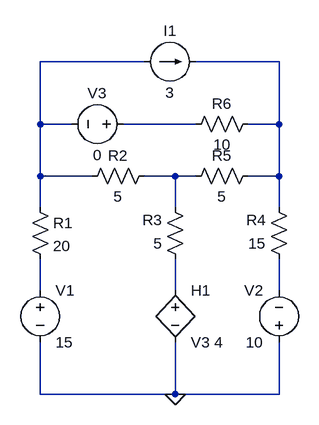
[diagram p0: schematic Draft29.asc]
Draft29.asc, the LTspice schematic file:
Version 4
SHEET 1 880 680
WIRE 208 -112 48 -112
WIRE 416 -112 288 -112
WIRE 48 -16 48 -112
WIRE 96 -16 48 -16
WIRE 288 -16 176 -16
WIRE 416 -16 416 -112
WIRE 416 -16 368 -16
WIRE 48 64 48 -16
WIRE 128 64 48 64
WIRE 256 64 208 64
WIRE 288 64 256 64
WIRE 416 64 416 -16
WIRE 416 64 368 64
WIRE 48 112 48 64
WIRE 256 112 256 64
WIRE 416 112 416 64
WIRE 48 240 48 192
WIRE 256 240 256 192
WIRE 416 240 416 192
WIRE 48 400 48 320
WIRE 256 400 256 320
WIRE 256 400 48 400
WIRE 416 400 416 320
WIRE 416 400 256 400
FLAG 256 400 0
SYMBOL voltage 48 224 R0
SYMATTR InstName V1
SYMATTR Value 15
SYMBOL res 32 96 R0
SYMATTR InstName R1
SYMATTR Value 20
SYMBOL res 224 48 R90
WINDOW 0 0 56 VBottom 2
WINDOW 3 32 56 VTop 2
SYMATTR InstName R2
SYMATTR Value 5
SYMBOL res 272 208 R180
WINDOW 0 36 76 Left 2
WINDOW 3 36 40 Left 2
SYMATTR InstName R3
SYMATTR Value 5
SYMBOL res 432 208 R180
WINDOW 0 36 76 Left 2
WINDOW 3 36 40 Left 2
SYMATTR InstName R4
SYMATTR Value 15
SYMBOL res 272 80 R270
WINDOW 0 32 56 VTop 2
WINDOW 3 0 56 VBottom 2
SYMATTR InstName R5
SYMATTR Value 5
SYMBOL voltage 416 336 R180
WINDOW 0 24 96 Left 2
WINDOW 3 24 16 Left 2
SYMATTR InstName V2
SYMATTR Value 10
SYMBOL h 256 224 R0
SYMATTR InstName H1
SYMATTR Value V3 4
SYMBOL current 208 -112 R270
WINDOW 0 32 40 VTop 2
WINDOW 3 -32 40 VBottom 2
SYMATTR InstName I1
SYMATTR Value 3
SYMBOL voltage 192 -16 R90
WINDOW 0 -32 56 VBottom 2
WINDOW 3 32 56 VTop 2
SYMATTR InstName V3
SYMATTR Value 0
SYMBOL res 384 -32 R90
WINDOW 0 0 56 VBottom 2
WINDOW 3 32 56 VTop 2
SYMATTR InstName R6
SYMATTR Value 10

The netlist it stands for:
* Draft29.asc
V1 N005 0 15
R1 N001 N005 20
R2 N004 N001 5
R3 N006 N004 5
R4 N007 N002 15
R5 N004 N002 5
V2 0 N007 10
H1 N006 0 V3 4
I1 N001 N002 3
V3 N003 N001 0
R6 N002 N003 10
.backanno
.end